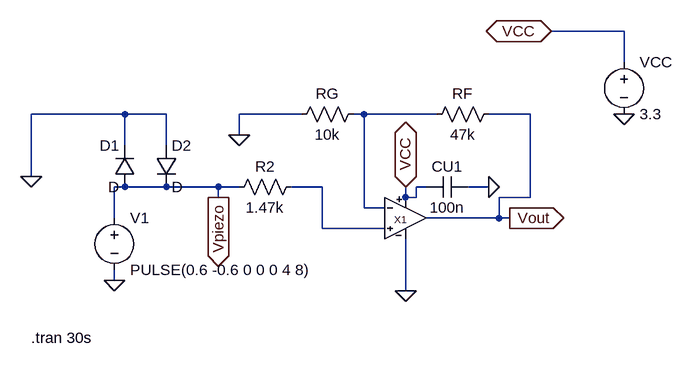
[diagram p0: schematic Circuit.asc]
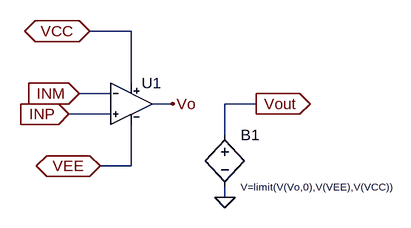
[diagram p1: sub-circuit tlv9054_x.asc]
Circuit.asc, the LTspice schematic file:
Version 4
SHEET 1 880 680
WIRE 784 -112 672 -112
WIRE 784 -64 784 -112
WIRE 16 16 -128 16
WIRE 80 16 16 16
WIRE 288 16 192 16
WIRE 384 16 368 16
WIRE 496 16 384 16
WIRE 640 16 576 16
WIRE 192 48 192 16
WIRE 16 64 16 16
WIRE 80 64 80 16
WIRE -128 112 -128 16
WIRE 16 128 0 128
WIRE 80 128 16 128
WIRE 160 128 80 128
WIRE 192 128 160 128
WIRE 320 128 272 128
WIRE 480 128 464 128
WIRE 576 128 544 128
WIRE 160 144 160 128
WIRE 448 144 448 128
WIRE 464 144 464 128
WIRE 464 144 448 144
WIRE 640 144 640 16
WIRE 640 144 592 144
WIRE 384 160 384 16
WIRE 416 160 384 160
WIRE 0 176 0 128
WIRE 592 176 592 144
WIRE 592 176 480 176
WIRE 608 176 592 176
WIRE 320 192 320 128
WIRE 416 192 320 192
WIRE 0 272 0 256
WIRE 448 288 448 208
FLAG 448 128 VCC
IOPIN 448 128 BiDir
FLAG 576 128 0
FLAG 608 176 Vout
IOPIN 608 176 Out
FLAG 0 272 0
FLAG 448 288 0
FLAG 672 -112 VCC
IOPIN 672 -112 BiDir
FLAG 784 16 0
FLAG 192 48 0
FLAG -128 112 0
FLAG 160 144 Vpiezo
IOPIN 160 144 Out
SYMBOL res 384 0 R90
WINDOW 0 0 56 VBottom 2
WINDOW 3 32 56 VTop 2
SYMATTR InstName RG
SYMATTR Value 10k
SYMBOL res 592 0 R90
WINDOW 0 0 56 VBottom 2
WINDOW 3 32 56 VTop 2
SYMATTR InstName RF
SYMATTR Value 47k
SYMBOL cap 544 112 R90
WINDOW 0 0 32 VBottom 2
WINDOW 3 32 32 VTop 2
SYMATTR InstName CU1
SYMATTR Value 100n
SYMBOL voltage 784 -80 R0
SYMATTR InstName VCC
SYMATTR Value 3.3
SYMBOL TLV9054_X 480 176 R0
SYMATTR InstName X1
SYMBOL voltage 0 160 R0
WINDOW 123 0 0 Left 0
WINDOW 39 0 0 Left 0
SYMATTR InstName V1
SYMATTR Value PULSE(0.6 -0.6 0 0 0 4 8)
SYMBOL res 288 112 R90
WINDOW 0 0 56 VBottom 2
WINDOW 3 32 56 VTop 2
SYMATTR InstName R2
SYMATTR Value 1.47k
SYMBOL diode 64 64 R0
SYMATTR InstName D2
SYMBOL diode 32 128 R180
WINDOW 0 24 64 Left 2
WINDOW 3 24 0 Left 2
SYMATTR InstName D1
TEXT -128 360 Left 2 !.tran 30s

tlv9054_x.asc, the sub-circuit schematic file:
Version 4
SHEET 1 880 680
WIRE 192 48 128 48
WIRE 192 128 192 48
WIRE 160 144 112 144
WIRE 256 160 224 160
WIRE 384 160 336 160
WIRE 160 176 96 176
WIRE 336 208 336 160
WIRE 192 256 192 192
WIRE 192 256 144 256
WIRE 336 304 336 288
FLAG 384 160 Vout
IOPIN 384 160 Out
FLAG 128 48 VCC
IOPIN 128 48 BiDir
FLAG 144 256 VEE
IOPIN 144 256 BiDir
FLAG 112 144 INM
IOPIN 112 144 In
FLAG 96 176 INP
IOPIN 96 176 In
FLAG 336 304 0
FLAG 256 160 Vo
SYMBOL TLV9054 192 160 R0
SYMATTR InstName U1
SYMBOL bv 336 192 R0
WINDOW 3 24 96 Left 1
SYMATTR InstName B1
SYMATTR Value V=limit(V(Vo,0),V(VEE),V(VCC))

The netlist it stands for:
* Circuit.asc
RG N001 0 10k
RF Vout N001 47k
CU1 0 VCC 100n
VCC VCC 0 3.3
XX1 N001 N002 VCC 0 Vout tlv9054_x
V1 Vpiezo 0 PULSE(0.6 -0.6 0 0 0 4 8)
R2 N002 Vpiezo 1.47k
D2 0 Vpiezo D
D1 Vpiezo 0 D

* block symbol definitions
.subckt tlv9054_x INM INP VCC VEE Vout
XU1 INP INM VCC VEE Vo TLV9054  ; pins IN+ IN- VCC VEE OUT
B1 Vout 0 V=limit(V(Vo,0),V(VEE),V(VCC))
.ends tlv9054_x

.model D D
.lib standard.dio
.tran 30s
.lib TLV9054.lib
.backanno
.end

* Results of the author's LTspice run, read from the files saved beside the schematic
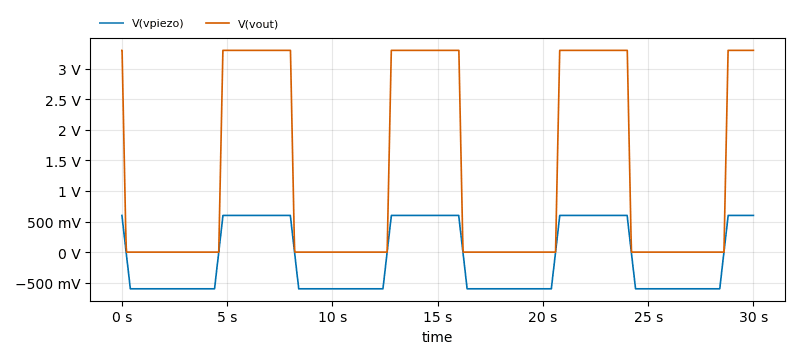
[diagram p2: Transient Analysis of Circuit.asc, plotted from the saved traces]
* Transient Analysis, 1 run:
*   V(vpiezo): min -600 mV, max 600 mV, average -104 mV, rms 578.5 mV, last 600 mV
*   V(vout): min 0 V, max 3.3 V, average 1.279 V, rms 2.033 V, last 3.3 V